# EAGLE design cnc-spindle-driver (EAGLE 7.7.0)
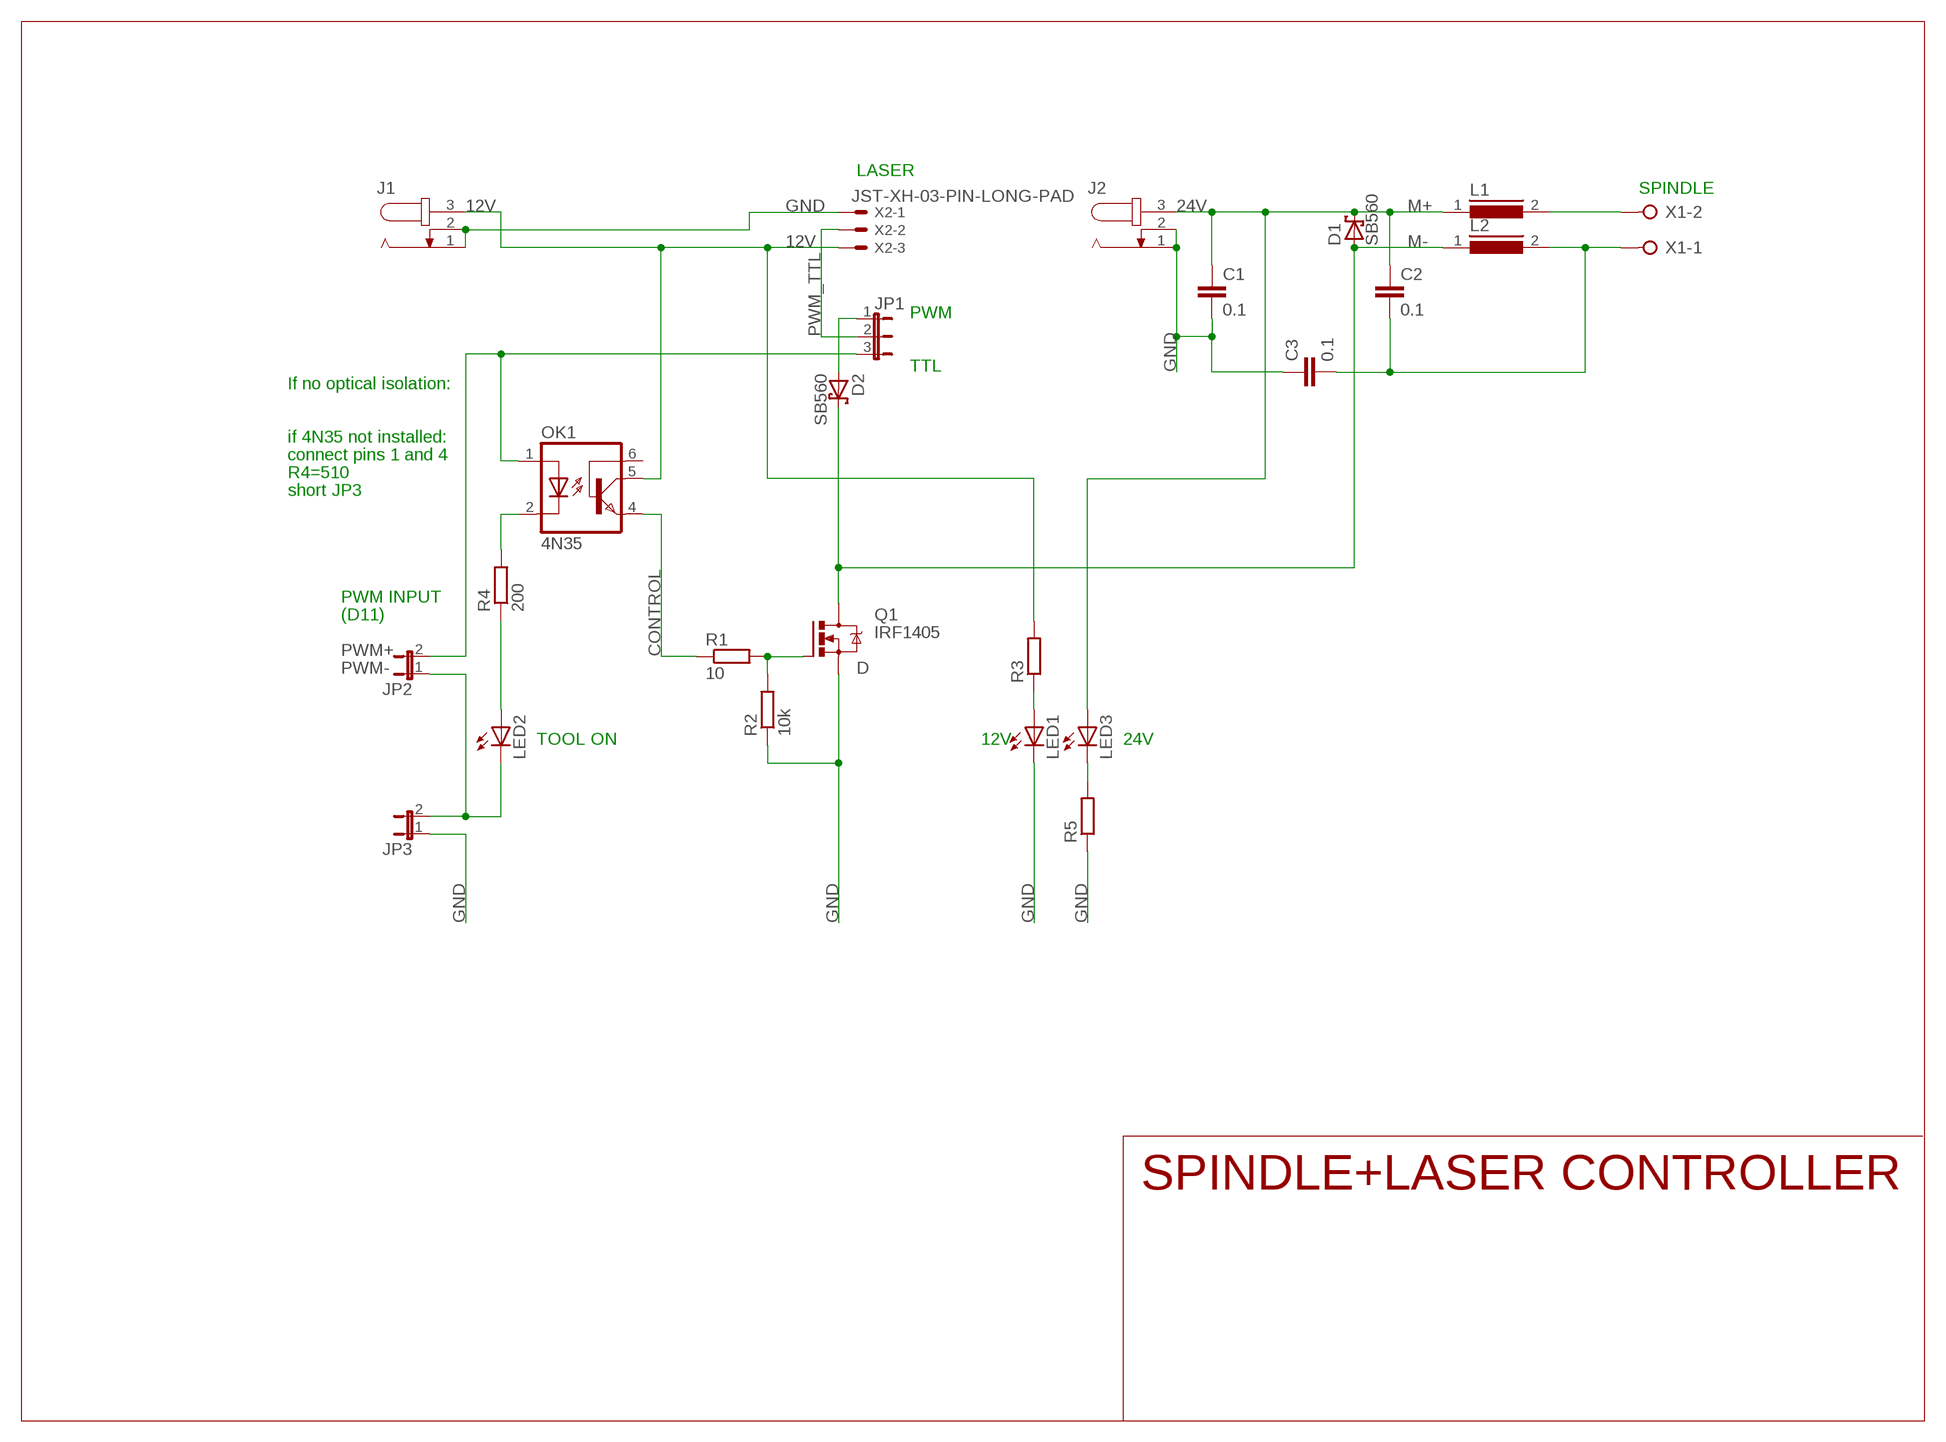
[diagram p0: schematic, sheet 1]

## Parts
C1  0.1  C-EU025-025X050  [C025-025X050]
C2  0.1  C-EU025-025X050  [C025-025X050]
C3  0.1  C-EU025-025X050  [C025-025X050]
D1  SB560  1N5817-B  [DO41-7.6]
D2  SB560  1N5817-B  [DO41-7.6]
J1  JACK-PLUG0  [SPC4077]
J2  JACK-PLUG0  [SPC4077]
JP1  JP2E  [JP2]
JP2  JP1E  [JP1]
JP3  JP1E  [JP1]
L1  R1003FS11  [S11-10]
L2  R1003FS11  [S11-10]
LED1  LED5MM  [LED5MM]
LED2  LED5MM  [LED5MM]
LED3  LED5MM  [LED5MM]
OK1  4N35  [DIL06]
Q1  IRF1405  IRF540  [TO220BV]
R1  10  R-EU_0207/10  [0207/10]
R2  10k  R-EU_0207/10  [0207/10]
R3  R-EU_0207/2V  [0207/2V]
R4  200  R-EU_0207/10  [0207/10]
R5  R-EU_0207/2V  [0207/2V]
X1  W237-02P  [W237-132]
X2  JST-XH-03-PIN-LONG-PAD  [JST-XH-03-PACKAGE-LONG-PAD]

## Nets
12V: J1.3 OK1.5(COL) R3.2 X2.3
24V: C1.1 C2.1 D1.C J2.3 L1.1 LED3.A
CONTROL: OK1.4(EMI) R1.1
D: D1.A D2.C L2.1 Q1.D
G: Q1.G R1.2 R2.2
GND: C1.2 C3.1 J1.1 J1.2 J2.1 J2.2 JP3.1 LED1.K(C) Q1.S R2.1 R5.1 X2.1
M+: L1.2 X1.2
M-: C2.2 C3.2 L2.2 X1.1
N$1: LED3.K(C) R5.2
N$2: D2.A JP1.1
N$5: LED2.A R4.1
N$6: OK1.2(C) R4.2
N$8: LED1.A R3.1
PWM+: JP1.3 JP2.2 OK1.1(A)
PWM-: JP2.1 JP3.2 LED2.K(C)
PWM_TTL: JP1.2 X2.2
Unconnected: OK1.6(BAS)

## Notes on the sheet
- LASER
- SPINDLE
- PWM
- TTL
- If no optical isolation:
- if 4N35 not installed:
- connect pins 1 and 4
- R4=510
- short JP3
- PWM INPUT
- (D11)
- TOOL ON | 12V | 24V
- SPINDLE+LASER CONTROLLER

## Library data of the parts
C1-C3 = rcl:C-EU: CAPACITOR, European symbol
D1 D2 = diode:1N581*: 1.0A SCHOTTKY BARRIER RECTIFIER Source: http://www.diodes.com/datasheets/ds23001.pdf
J1 J2 = con-jack:JACK-PLUG: DC POWER JACK Power Jack, DC, Right Angle, Through Hole, Rated 5A at 16VDC, PC Terminals Distributor: Farnell (www.Farnell.de) Drawing: 84N1161.pdf / 84N1162.pdf Manufacturer: SPC Technology (www.spctechnology.com) Type: SPC4077 / SPC 4078; OC_FARNELL: unknown; OC_NEWARK: unknown
JP1 = jumper:JP2E: JUMPER
JP2 JP3 = jumper:JP1E: JUMPER
L1 L2 = inductor-nkl:R1003F: Gegentakt-Entstördrossel differential mode choke; OC_FARNELL: unknown; OC_NEWARK: unknown
LED1-LED3 = led:LED: LED OSRAM: - CHIPLED LG R971, LG N971, LY N971, LG Q971, LY Q971, LO R971, LY R971 LH N974, LH R974 LS Q976, LO Q976, LY Q976 LO Q996 - Hyper CHIPLED LW Q18S LB Q993, LB Q99A, LB R99A - SideLED LS A670, LO A670, LY A670, LG A670, LP A670 LB A673, LV A673, LT A673, LW A673 LH A674 LY A675 LS A676, LA A676, LO A676, LY A676, LW A676 LS A679, LY A679, LG A679 - Hyper Micro SIDELED® LS Y876, LA Y876, LO Y876, LY Y876 LT Y87S - SmartLED LW L88C, LW L88S LB L89C, LB L89S, LG L890 LS L89K, LO L89K, LY L89K LS L896, LA L896, LO L896, LY L896 - TOPLED LS T670, LO T670, LY T670, LG T670, LP T670 LSG T670, LSP T670, LSY T670, LOP T670, LYG T670 LG T671, LOG T671, LSG T671 LB T673, LV T673, LT T673, LW T673 LH T674 LS T676, LA T676, LO T676, LY T676, LB T676, LH T676, LSB T676, LW T676 LB T67C, LV T67C, LT T67C, LS T67K, LO T67K, LY T67K, LW E67C LS E67B, LA E67B, LO E67B, LY E67B, LB E67C, LV E67C, LT E67C LW T67C LS T679, LY T679, LG T679 LS T770, LO T770, LY T770, LG T770, LP T770 LB T773, LV T773, LT T773, LW T773 LH T774 LS E675, LA E675, LY E675, LS T675 LS T776, LA T776, LO T776, LY T776, LB T776 LHGB T686 LT T68C, LB T68C - Hyper Mini TOPLED® LB M676 - Mini TOPLED Santana® LG M470 LS M47K, LO M47K, LY M47K Source: http://www.osram.convergy.de LUXEON: - LUMILED® LXK2-PW12-R00, LXK2-PW12-S00, LXK2-PW14-U00, LXK2-PW14-V00 LXK2-PM12-R00, LXK2-PM12-S00, LXK2-PM14-U00 LXK2-PE12-Q00, LXK2-PE12-R00, LXK2-PE12-S00, LXK2-PE14-T00, LXK2-PE14-U00 LXK2-PB12-K00, LXK2-PB12-L00, LXK2-PB12-M00, LXK2-PB14-N00, LXK2-PB14-P00, LXK2-PB14-Q00 LXK2-PR12-L00, LXK2-PR12-M00, LXK2-PR14-Q00, LXK2-PR14-R00 LXK2-PD12-Q00, LXK2-PD12-R00, LXK2-PD12-S00 LXK2-PH12-R00, LXK2-PH12-S00 LXK2-PL12-P00, LXK2-PL12-Q00, LXK2-PL12-R00 Source: www.luxeon.com KINGBRIGHT: KA-3528ASYC Source: www.kingbright.com
OK1 = optocoupler:4N35: MOTOROLA OPTO COUPLER; MF: FAIRCHILD SEMICONDUCTOR; MPN: 4N35; OC_FARNELL: 1328375; OC_NEWARK: 72K9946
Q1 = transistor-power:IRF540: HEXFET Power MOSFET
R1-R5 = rcl:R-EU_: RESISTOR, European symbol
X1 = con-wago-508:W237-02P: WAGO SREW CLAMP; OC_FARNELL: unknown; OC_NEWARK: unknown
X2 = xh:JST-XH-03-PIN: JST XH Connector 2 Pin Wire to board connector. Pitch: 2,54 mm, (0.100") Number of pins: 3 Created by Rembrandt Electronics www.rembrandtelectronics.com

## Board
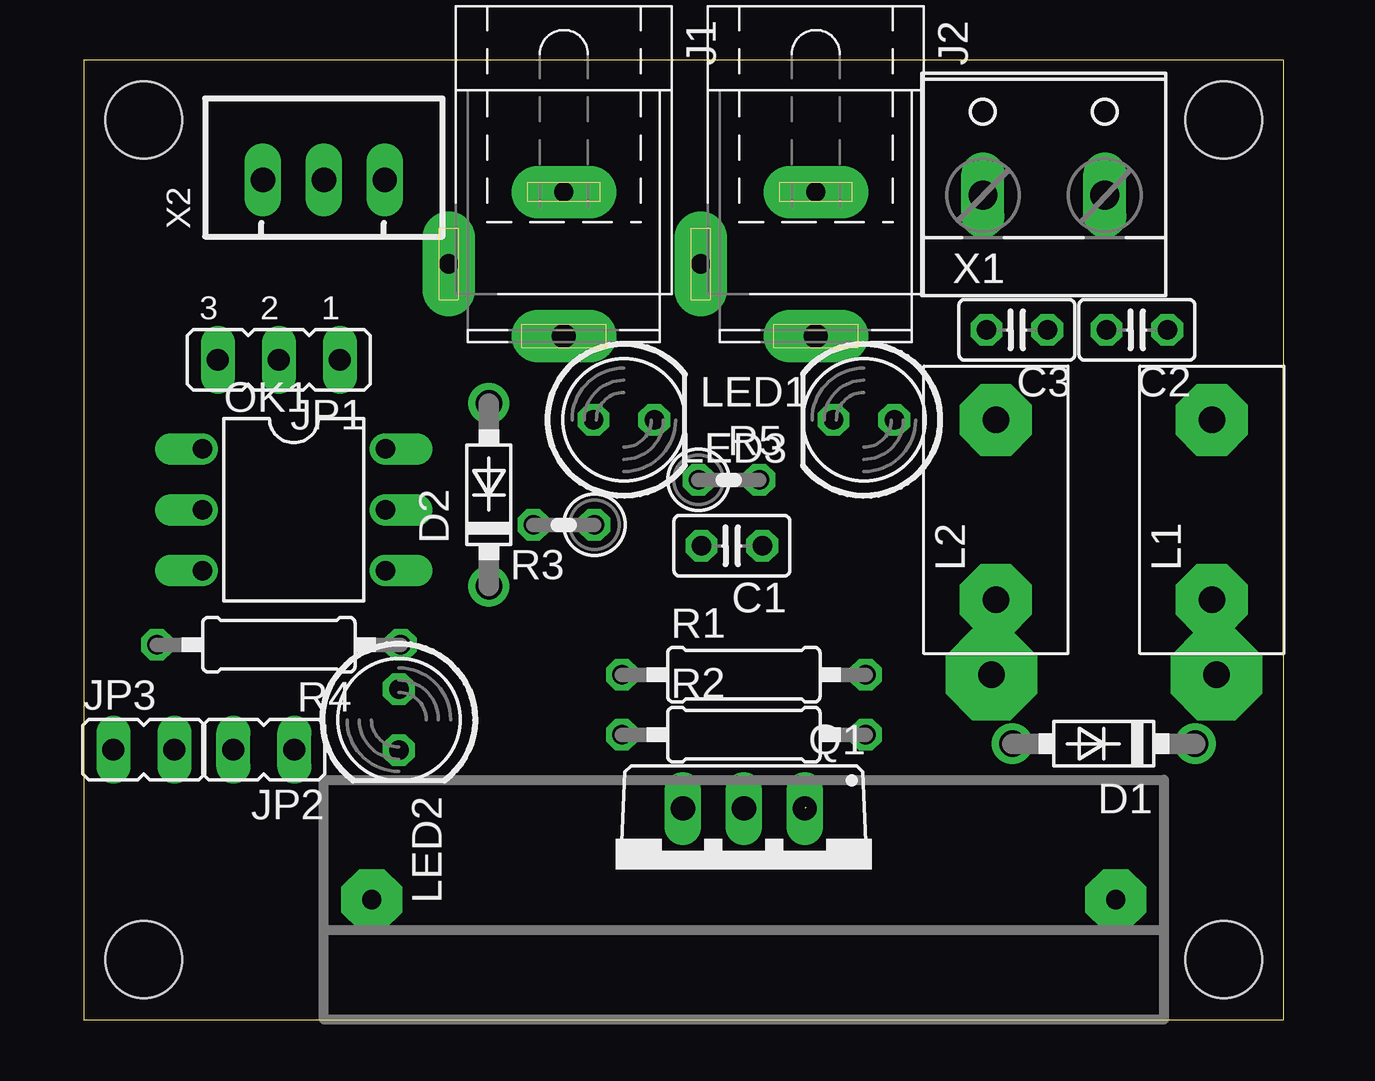
[diagram p1: board, top side]
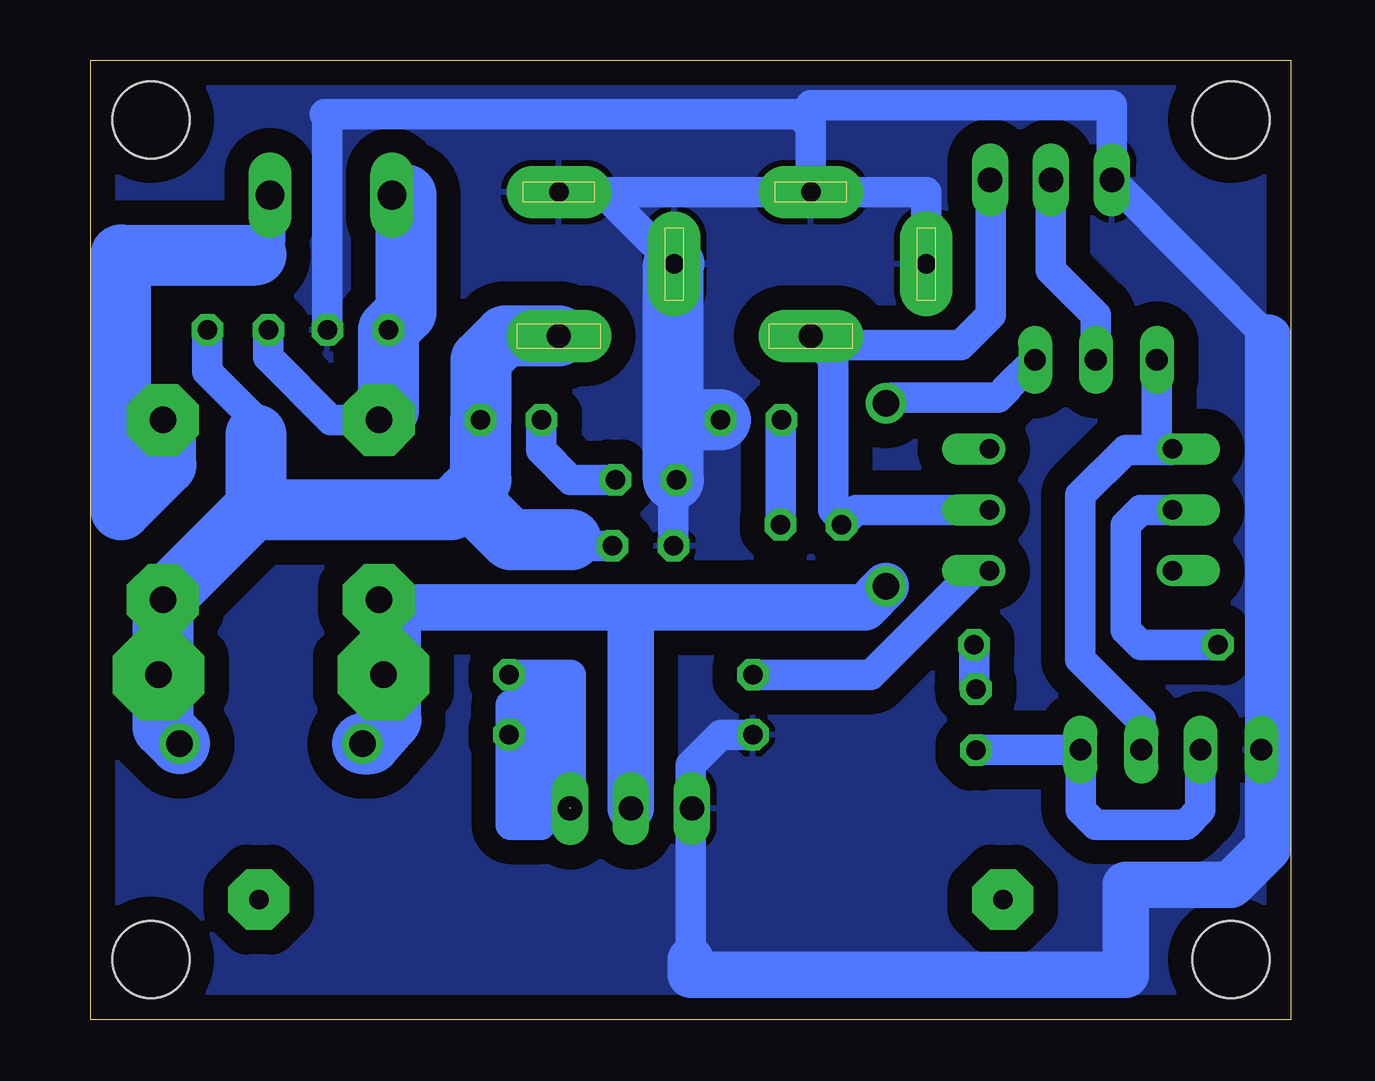
[diagram p2: board, bottom side, seen from below]

Size 50 x 40 mm. Coordinates in mm from the lower left corner, seen from the top.
Outline: 0,0 50,0 50,40 0,40 0,0
Copper layers (1*16): Top 0.035mm / dielectric 1.5mm / Bottom 0.035mm
Design rules "default": minimum track width 10mil, minimum drill 24mil, track to track 8mil, track to pad 8mil, pad to pad 8mil, via to via 8mil, smd to smd 8mil, copper to edge 40mil, drill to drill 8mil, minimum pad ring 10mil, minimum via ring 8mil, stop-mask expansion 4mil, vias tented up to drill 0mil, thermal gap 10mil
Holes 3.2 mm at 2.5,2.5 47.5,2.5 47.5,37.5 2.5,37.5

### Footprints (pad centres in the part's own frame; a part is rotated, then mirrored left to right if it is on the bottom)
C025-025X050 = drill 0.813 octagon: 1 -1.27,0; 2 1.27,0
DO41-7.6 = drill 1.1 pad 1.7: A 3.81,0; C -3.81,0
SPC4077 = drill 0.8 pad 2.184 long: 1 -3,0; 2 0,-4.8 | drill 1 pad 2.184 long: 3 3,0
JP2 = drill 0.914 long: 1 -2.54,0; 2 0,0; 3 2.54,0
JP1 = drill 0.914 long: 1 0,-1.27; 2 0,1.27
S11-10 = drill 1.1 pad 3 octagon: 1 -3.75,0; 2 3.75,0
LED5MM = drill 0.813 octagon: A -1.27,0; K 1.27,0
DIL06 = drill 0.813 offset: 1 -2.54,-3.81; 2 0,-3.81; 3 2.54,-3.81; 4 2.54,3.81; 5 0,3.81; 6 -2.54,3.81
TO220BV = drill 1.016 long: D 0,-2.54; G -2.54,-2.54; S 2.54,-2.54
0207/10 = drill 0.813 octagon: 1 -5.08,0; 2 5.08,0
0207/2V = drill 0.813 octagon: 1 -1.27,0; 2 1.27,0
W237-132 = drill 1.194 long: 1 -2.54,-0.635; 2 2.54,-0.635
JST-XH-03-PACKAGE-LONG-PAD = drill 1.016 long: 1 -2.54,0; 2 0,0; 3 2.54,0

### Placement (x,y rotation side)
C1  27,19.75 180 top
C2  43.88,28.75 180 top
C3  38.88,28.75 180 top
D1  42.5,11.5 180 top
D2  16.88,21.88 90 top
J1  20,31.5 270 top
J2  30.5,31.5 270 top
JP1  8.12,27.5 180 top
JP2  7.5,11.25 90 top
JP3  2.5,11.25 270 top
L1  47,21.25 90 top
L2  38,21.25 90 top
LED1  22.5,25 0 top
LED2  13.12,12.5 270 top
LED3  32.5,25 180 top
OK1  8.75,21.25 270 top
Q1  27.5,6.26 180 top
R1  27.5,14.38 0 top
R2  27.5,11.88 0 top
R3  20,20.62 180 top
R4  8.12,15.62 180 top
R5  26.88,22.5 0 top
X1  40,35 0 top
X2  10,35 0 top

### Tracks (layer width: path | path; a pad name or v marks a point on that pad's centre or on a via)
12V
  Bottom 1.27: X2.3 12.5,34.96 12.5,29.38 13.75,28.12 19.62,28.12 | OK1.5 18.11,21.25 R3.2 18.73,20.92 19.06,21.25 19.06,27.56 19.62,28.12 | 19.62,28.12 J1.3
24V
  Bottom 1.27: C2.1 45.15,27.02 43.12,25 43.12,24.38 | C1.1 29.75,19.75 30,20
  Bottom 2.54: J2.3 32.75,28.5 33.75,27.5 33.75,25.02 LED3.A 33.77,22.52 33.75,22.5 34.38,21.88 | 34.38,21.88 35,21.25 42.5,21.25 | 42.5,21.25 43.25,21.25 L1.1 47,12.19 D1.C | 30,20 32.5,20 34.38,21.88 | 43.12,24.38 43.12,21.88 42.5,21.25
CONTROL
  Bottom 1.27: R1.1 17.5,14.38 13.12,18.75 12.6,18.75 OK1.4
D
  Bottom 1.93: 27.5,17.19 37.69,17.19 L2.1 | Q1.D 27.5,17.19 | 27.5,17.19 22.5,17.19 17.75,17.19 D2.C
  Bottom 2.54: D1.A 38.38,11.5 37.5,12.5 37.5,17 L2.1
G  (1 unrouted)
  Bottom 1.27: 30.08,8.84 30,8.84 30,11.25 | 30,11.25 30,14.38 R1.2 | R2.2 32.5,11.88 | 32.5,11.88 32.5,13.12 30.62,13.12 30.62,11.88 32.5,11.88 | 32.5,11.88 32.5,8.12 31.25,8.12 31.25,11.25 30,11.25
GND
  Bottom 1.27: 20,37.25 20,38.12 7.46,38.12 X2.1 0.94,28.44 | 20,37.25 J1.1 | J1.2 15.2,34.5 J1.1 | J2.1 28.7,34.5 | 28.7,34.5 J2.2 | J1.1 28.7,34.5 | C3.1 40.15,37.65 40.25,37.75 20.5,37.75 20,37.25 | R5.1 25.75,22.48 25.73,22.5 C1.2 | 25,2.5 25,8.76 Q1.S 25,8.84 25,10.62 23.75,11.88 R2.1 | 0.94,10.96 JP3.1
  Bottom 1.93: 0.94,28.44 0.94,10.96 0.94,7.19 2.5,5.62 6.88,5.62 6.88,1.88 25,1.88 25,2.5
  Bottom 2.54: 25.73,22.5 25.73,25 | 25.73,25 25.73,31.47 J2.2 | LED1.K 25.73,25
  pour Bottom (isolate 1.016): 0,0 50,0 50,40 0,40
M+
  Bottom 1.27: 43.12,31.88 42.53,32.5 X1.2
  Bottom 2.54: 47.5,25 L1.2 46.88,24.88 46.88,23.12 48.75,21.25 48.75,31.88 43.12,31.88
M-
  Bottom 1.27: C2.2 42.6,27.61 40,25 L2.2 | X1.1 36.88,34.37 36.88,34.38
  Bottom 2.54: 36.88,34.38 36.88,29.48 C3.2 37.6,25.39 L2.2
N$1
  Bottom 1.27: LED3.K 31.23,23.73 30,22.5 R5.2
N$2
  Bottom 1.27: JP1.1 11.86,26.31 11.86,26.27 12.19,25.94 16.62,25.94 D2.A
N$3  (via drill 0.8 pad 2.54)
  other vias: 12,5
N$4  (via drill 0.8 pad 2.54)
  other vias: 43,5
N$5
  Bottom 1.27: R4.1 13.21,13.85 LED2.A
N$6
  Bottom 1.27: OK1.2 6.25,21.25 6.88,20.62 6.88,16.25 6.25,15.62 R4.2
N$8
  Bottom 1.27: LED1.A 21.25,24.98 21.25,20.64 R3.1
N$9  (via drill 1.1 pad 3.81)
  other vias: 37.81,14.38
N$10  (via drill 1.1 pad 3.81)
  other vias: 47.19,14.38
PWM+
  Bottom 1.27: 5.62,23.75 6.88,23.75 8.77,21.86 8.77,15.02 6.25,12.5 6.25,11.27 JP2.2 | 5.62,23.75 4.98,23.75 OK1.1 | JP1.3 5.58,23.79 5.62,23.75
PWM-
  Bottom 1.27: JP3.2 3.77,8.73 4.38,8.12 8.12,8.12 8.75,8.75 8.75,11.23 JP2.1 13.11,11.25 LED2.K
PWM_TTL
  Bottom 1.27: JP1.2 8.12,29.38 10,31.25 X2.2

### Text on the board
tDocu: LASER | 12V | 24V | SPINDLE